# Altium schematic sheet alim.SchDoc
size A4
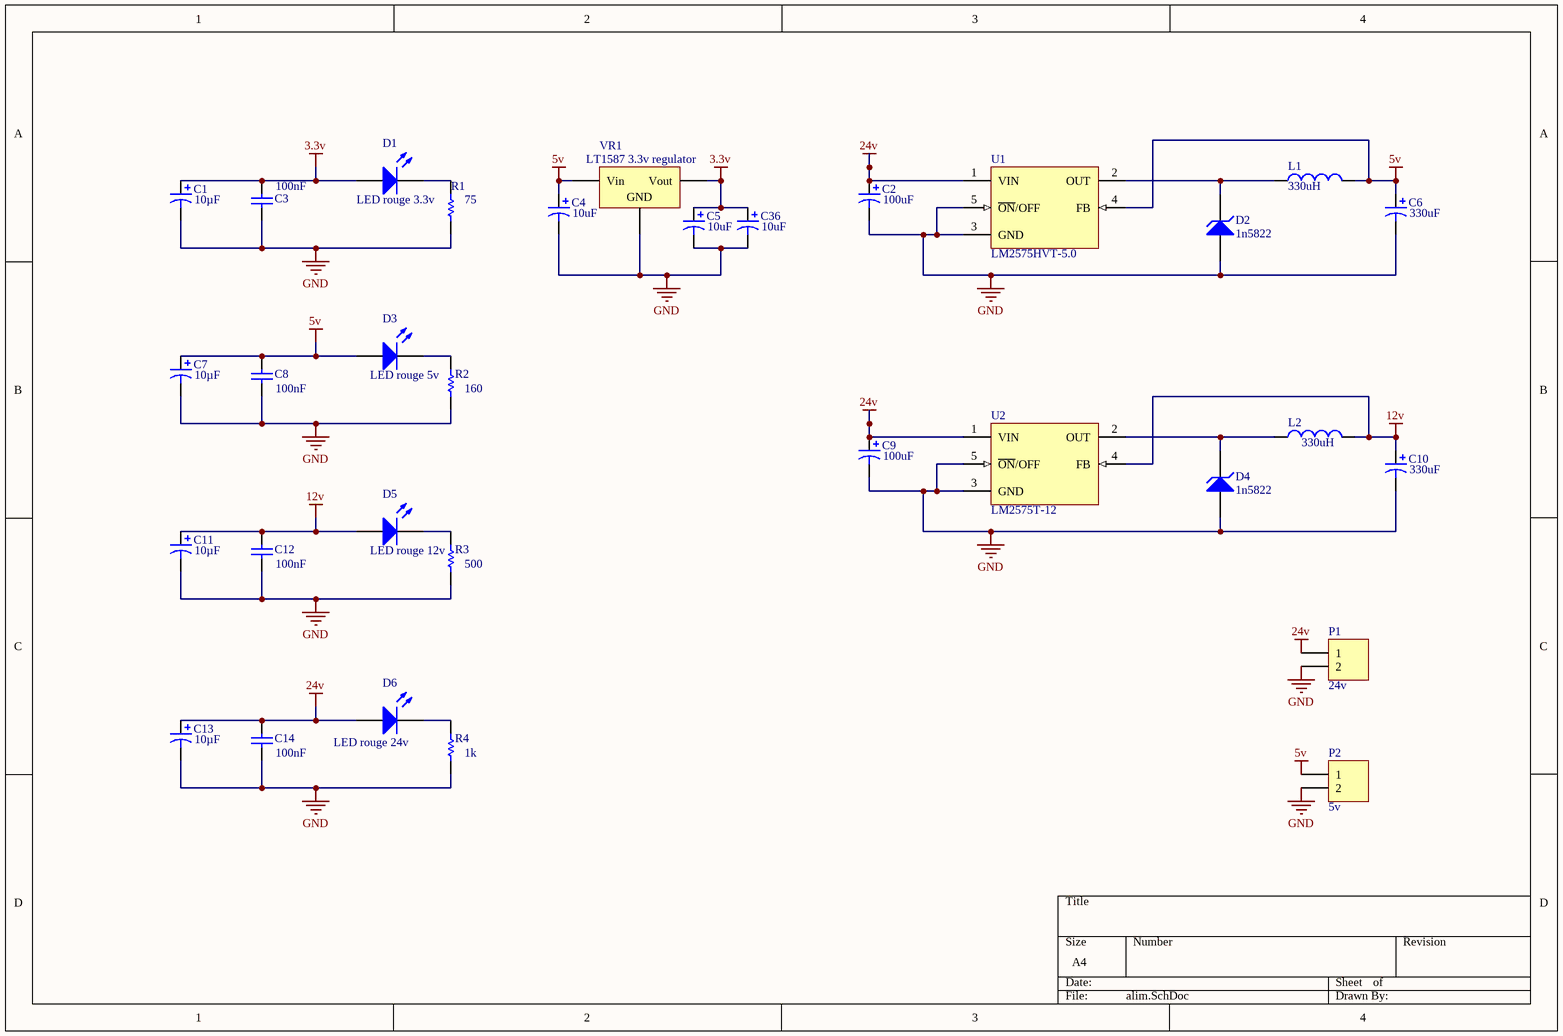
[diagram p0: alim.SchDoc]

## Parts
C1  value 10µF  [CAPC3216L]  (hidden comment: Cap Pol3)
C2  value 100uF  [CAPPR2-5x6.8]  (hidden comment: Cap Pol3)
C3  value 100nF  [CAPC1608L]  (hidden comment: Cap)
C4  value 10uF  [CAPC3216L]  (hidden comment: Cap Pol3)
C5  value 10uF  [CAPC3216L]  (hidden comment: Cap Pol3)
C6  value 330uF  [CAPPR5-10x12.5]  (hidden comment: Cap Pol3)
C7  value 10µF  [CAPC3216L]  (hidden comment: Cap Pol3)
C8  value 100nF  [CAPC1608L]  (hidden comment: Cap)
C9  value 100uF  [CAPPR2-5x6.8]  (hidden comment: Cap Pol3)
C10  value 330uF  [CAPPR5-10x12.5]  (hidden comment: Cap Pol3)
C11  value 10µF  [CAPC3216L]  (hidden comment: Cap Pol3)
C12  value 100nF  [CAPC1608L]  (hidden comment: Cap)
C13  value 10µF  [CAPC3216L]  (hidden comment: Cap Pol3)
C14  value 100nF  [CAPC1608L]  (hidden comment: Cap)
C36  value 10uF  [CAPC3216L]  (hidden comment: Cap Pol3)
D1  LED rouge 3.3v  [3.2X1.6X1.1]
D2  1n5822  [DIO18.84-9.6x5.6]
D3  LED rouge 5v  [3.2X1.6X1.1]
D4  1n5822  [DIODE-0.7]
D5  LED rouge 12v  [3.2X1.6X1.1]
D6  LED rouge 24v  [3.2X1.6X1.1]
L1  value 330uH  [CAPC4532L]  (hidden comment: Inductor)
L2  value 330uH  [CAPC4532L]  (hidden comment: Inductor)
P1  24v  [power connector]
P2  5v  [power connector]
R1  value 75  [RESC1608L]  (hidden comment: Res1)
R2  value 160  [RESC1608L]  (hidden comment: Res1)
R3  value 500  [RESC1608L]  (hidden comment: Res1)
R4  value 1k  [RESC1608L]  (hidden comment: Res1)
U1  LM2575HVT-5.0  [TO170P1524X460-6N]
U2  LM2575T-12  [TO170P1524X460-6N]
VR1  LT1587 3.3v regulator  [TO254P1435X457-4N]

## Nets
3.3v: C1.1 C3.2 C5.1 C36.1 D1.1(A) VR1.3(Vout)
5v: C4.1 C6.1 C7.1 C8.2 D3.1(A) L1.2 P2.1 U1.4(FB) VR1.1(Vin)
12v: C10.1 C11.1 C12.2 D5.1(A) L2.2 U2.4(FB)
24v: C2.1 C9.1 C13.1 C14.2 D6.1(A) P1.1 U1.1(VIN) U2.1(VIN)
GND: C1.2 C2.2 C3.1 C4.2 C5.2 C6.2 C7.2 C8.1 C9.2 C10.2 C11.2 C12.1 C13.2 C14.1 C36.2 D2.1(A) D4.1(A) P1.2 P2.2 R1.1 R2.1 R3.1 R4.1 U1.3(GND) U1.5(~{ON}/OFF) U2.3(GND) U2.5(~{ON}/OFF) VR1.2(GND)
NetD1_2: D1.2(K) R1.2
NetD2_2: D2.2(K) L1.1 U1.2(OUT)
NetD3_2: D3.2(K) R2.2
NetD4_2: D4.2(K) L2.1 U2.2(OUT)
NetD5_2: D5.2(K) R3.2
NetD6_2: D6.2(K) R4.2

## Library data of the parts
C1 C2 C4-C7 C9-C11 C13 C36 = Cap Pol3: Polarized Capacitor (Surface Mount); Published: 8-Jun-2000; LatestRevisionDate: 29-May-2009; LatestRevisionNote: IPC-7351 Footprint Added.; PackageReference: C0805; Publisher: Altium Limited; PackageDescription: Chip Capacitor
C3 C8 C12 C14 = Cap: Capacitor; Published: 8-Jun-2000; LatestRevisionDate: 17-Jul-2002; LatestRevisionNote: Re-released for DXP Platform.; PackageReference: RAD-0.3; Publisher: Altium Limited
D1 D3 D5 D6 = LED2: Typical RED, GREEN, YELLOW, AMBER GaAs LED; Published: 8-Jun-2000; LatestRevisionDate: 17-Jul-2002; LatestRevisionNote: Re-released for DXP Platform.; PackageVersion: Feb-2002; PackageReference: 3.2X1.6X1.1; Publisher: Altium Limited
D2 D4 = D Zener: Zener Diode; Published: 8-Jun-2000; LatestRevisionDate: 17-Jul-2002; LatestRevisionNote: Re-released for DXP Platform.; PackageReference: DIODE-0.7; Publisher: Altium Limited
L1 L2 = Inductor: Code_IEC: 1005; Published: 8-Jun-2000; LatestRevisionDate: 29-May-2009; LatestRevisionNote: IPC-7351 Footprint Added.; PackageReference: 0402-A; Publisher: Altium Limited; PackageDescription: Chip Inductor; Code_JEITA: 0402
P1 P2 = Header 2: Header, 2-Pin; LatestRevisionDate: 17-Jul-2002; LatestRevisionNote: Re-released for DXP Platform.; Publisher: Altium Limited
R1-R4 = Res1: Resistor; Published: 8-Jun-2000; LatestRevisionDate: 17-Jul-2002; LatestRevisionNote: Re-released for DXP Platform.; PackageReference: AXIAL-0.3; Publisher: Altium Limited
U1 = LM2575HVT-5.0: SIMPLE SWITCHER 1A Step-Down Voltage Regulator; Manufacturer: National Semiconductor; PackageTopMarking: NSUZXYTT*LM2575HVT*-5.0 P+; PowerWise: N; Published: 4-Dec-2008; DatasheetVersion: Apr-2007; PackageVersion: revJ, Jan-1992; PackageReference: T05A; Publisher: Altium Limited; PackageDescription: TO-220, Molded, 5 Lead, Straight; CompType: Switcher; PartNumber: LM2575HVT-5.0; RoHS: O; PinCount: 5; DigiKeyPartNumber: LM2575HVT-5.0-ND; Code_JEDEC: TO-220-AB; ComponentLink1Description: LM2575HV Datasheet; ComponentLink1URL: http://www.national.com/ds/LM/LM2575HV.pdf; ComponentLink2Description: LM2575HV Web Page; ComponentLink2URL: http://www.national.com/pf/LM/LM2575HV.html; ComponentLink3Description: T05A Package Page; ComponentLink3URL: http://www.national.com/packaging/folders/t05a.html
U2 = LM2575T-12: SIMPLE SWITCHER 1A Step-Down Voltage Regulator; Manufacturer: National Semiconductor; PackageTopMarking: NSUZXYTT*LM2575T*-12 P+; PowerWise: N; Published: 4-Dec-2008; DatasheetVersion: Apr-2007; PackageVersion: revJ, Jan-1992; PackageReference: T05A; Publisher: Altium Limited; PackageDescription: TO-220, Molded, 5 Lead, Straight; CompType: Switcher; PartNumber: LM2575T-12; RoHS: O; PinCount: 5; DigiKeyPartNumber: LM2575T-12-ND; Code_JEDEC: TO-220-AB; ComponentLink1Description: LM2575 Datasheet; ComponentLink1URL: http://www.national.com/ds/LM/LM2575.pdf; ComponentLink2Description: LM2575 Web Page; ComponentLink2URL: http://www.national.com/pf/LM/LM2575.html; ComponentLink3Description: T05A Package Page; ComponentLink3URL: http://www.national.com/packaging/folders/t05a.html
VR1 = Volt Reg: Voltage Regulator; Published: 24-Mar-1999; LatestRevisionDate: 29-May-2009; LatestRevisionNote: IPC-7351 Footprint Added.; PackageReference: D2PAK; Publisher: Altium Limited; PackageDescription: 3-Pin Transistor Outline Package 2.54 mm Pitch, 15.1 mm Lead Span